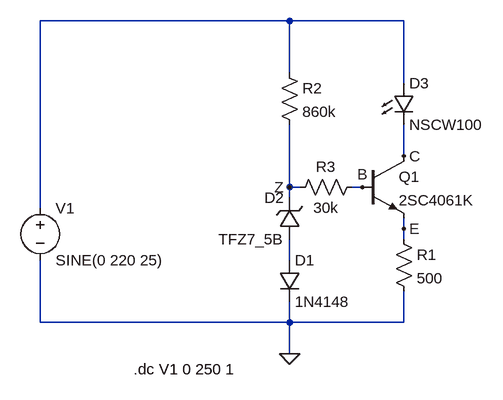
[diagram p0: schematic zener_and_silicone.asc]
zener_and_silicone.asc, the LTspice schematic file:
Version 4
SHEET 1 880 680
WIRE 112 -80 -272 -80
WIRE 288 -80 112 -80
WIRE 112 0 112 -80
WIRE 288 16 288 -80
WIRE 288 128 288 80
WIRE 112 176 112 80
WIRE 128 176 112 176
WIRE 224 176 208 176
WIRE 112 192 112 176
WIRE -272 208 -272 -80
WIRE 288 240 288 224
WIRE 288 256 288 240
WIRE 112 288 112 256
WIRE -272 384 -272 288
WIRE 112 384 112 352
WIRE 112 384 -272 384
WIRE 288 384 288 336
WIRE 288 384 112 384
WIRE 112 432 112 384
FLAG 112 432 0
FLAG 224 176 B
FLAG 288 128 C
FLAG 288 240 E
FLAG 112 176 Z
SYMBOL voltage -272 192 R0
WINDOW 123 0 0 Left 0
WINDOW 39 0 0 Left 0
SYMATTR InstName V1
SYMATTR Value SINE(0 220 25)
SYMBOL LED 272 16 R0
SYMATTR InstName D3
SYMATTR Value NSCW100
SYMBOL zener 128 256 R180
WINDOW 0 24 64 Left 2
WINDOW 3 24 0 Left 2
SYMATTR InstName D2
SYMATTR Value TFZ7_5B
SYMATTR Description Diode
SYMATTR Type diode
SYMBOL npn 224 128 R0
SYMATTR InstName Q1
SYMATTR Value 2SC4061K
SYMBOL res 272 240 R0
SYMATTR InstName R1
SYMATTR Value 500
SYMBOL res 96 -16 R0
SYMATTR InstName R2
SYMATTR Value 860k
SYMBOL res 224 160 R90
WINDOW 0 0 56 VBottom 2
WINDOW 3 32 56 VTop 2
SYMATTR InstName R3
SYMATTR Value 30k
SYMBOL diode 96 288 R0
SYMATTR InstName D1
SYMATTR Value 1N4148
TEXT -128 456 Left 2 !.dc V1 0 250 1

The netlist it stands for:
* zener_and_silicone.asc
V1 N001 0 SINE(0 220 25)
D3 N001 C NSCW100
D2 N002 Z TFZ7_5B
Q1 C B E 0 2SC4061K
R1 E 0 500
R2 N001 Z 860k
R3 B Z 30k
D1 N002 0 1N4148
.model D D
.lib standard.dio
.model NPN NPN
.model PNP PNP
.lib standard.bjt
.dc V1 0 250 1
.backanno
.end